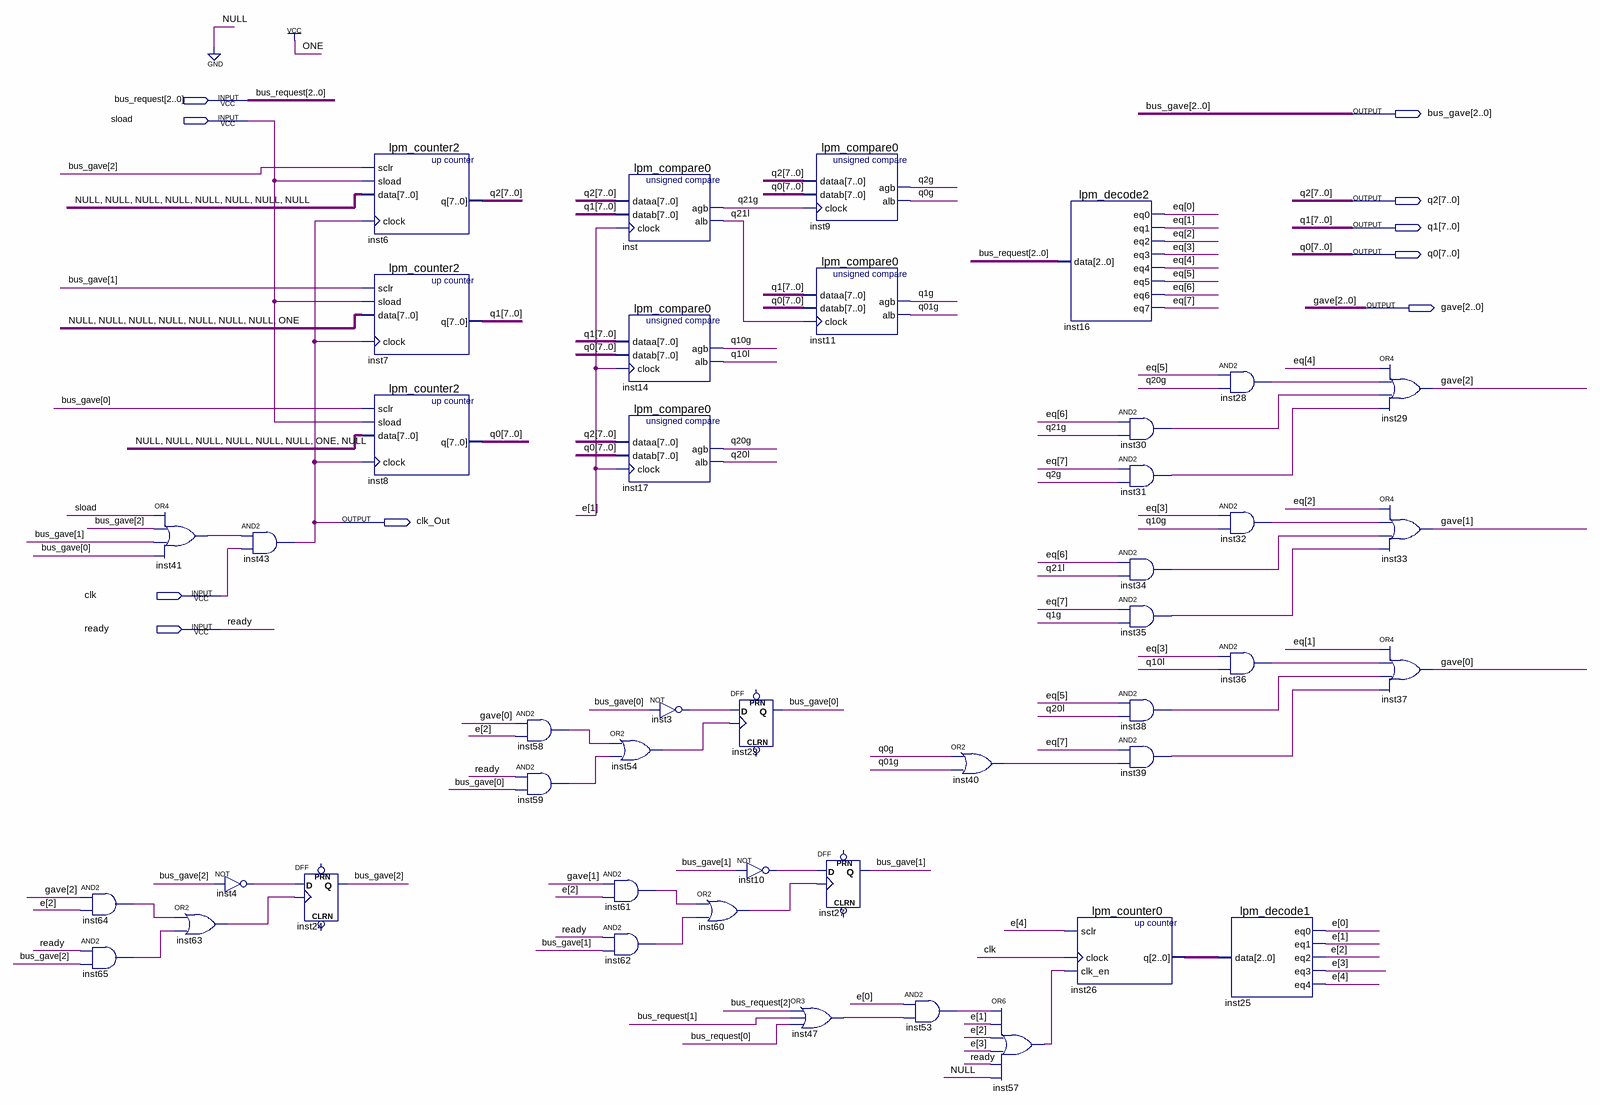
[diagram p0: schematic sheet]
// Quartus schematic arbitrator.bdf as structural Verilog: 44 symbols, 10 pins
module arbitrator (
  input  [2:0] bus_request,
  input  sload,
  input  clk,
  input  ready,
  output [2:0] bus_gave,
  output [7:0] q2,
  output [7:0] q1,
  output [7:0] q0,
  output [2:0] gave,
  output clk_Out
);

  wire inst3_out, inst4_out, inst10_out, inst28_out, inst30_out, inst31_out, inst32_out, inst34_out,
       inst35_out, inst36_out, inst38_out, inst39_out, inst40_out, inst41_out, inst47_out, inst53_out,
       inst54_out, inst57_out, inst58_out, inst59_out, inst60_out, inst61_out, inst62_out, inst63_out,
       inst64_out, inst65_out, q0g, q1g, q01g, q2g, q10g, q10l, q20g, q20l, q21g, q21l;
  wire [2:0] inst26_q;
  wire [4:0] e;
  wire [7:0] eq;

  and inst64 (inst64_out, gave[2], e[2]);
  and inst65 (inst65_out, ready, bus_gave[2]);
  or inst41 (inst41_out, sload, bus_gave[2], bus_gave[1], bus_gave[0]);
  or inst63 (inst63_out, inst64_out, inst65_out);
  and inst43 (clk_Out, inst41_out, clk);
  not inst4 (inst4_out, bus_gave[2]);
  DFF inst24 (.CLK(inst63_out), .D(inst4_out), .Q(bus_gave[2]));  // open: CLRN, PRN
  lpm_counter2 inst6 (.sclr(bus_gave[2]), .sload(sload), .data({8{1'b0}}), .clock(clk_Out), .q(q2));
  lpm_counter2 inst7 (.sclr(bus_gave[1]), .sload(sload), .data(8'b00000001), .clock(clk_Out), .q(q1));
  lpm_counter2 inst8 (.sclr(bus_gave[0]), .sload(sload), .data(8'b00000010), .clock(clk_Out), .q(q0));
  and inst58 (inst58_out, gave[0], e[2]);
  and inst59 (inst59_out, ready, bus_gave[0]);
  lpm_compare0 inst (.dataa(q2), .datab(q1), .clock(e[1]), .agb(q21g), .alb(q21l));
  lpm_compare0 inst14 (.dataa(q1), .datab(q0), .clock(e[1]), .agb(q10g), .alb(q10l));
  lpm_compare0 inst17 (.dataa(q2), .datab(q0), .clock(e[1]), .agb(q20g), .alb(q20l));
  or inst54 (inst54_out, inst58_out, inst59_out);
  and inst61 (inst61_out, gave[1], e[2]);
  and inst62 (inst62_out, ready, bus_gave[1]);
  not inst3 (inst3_out, bus_gave[0]);
  DFF inst23 (.CLK(inst54_out), .D(inst3_out), .Q(bus_gave[0]));  // open: CLRN, PRN
  not inst10 (inst10_out, bus_gave[1]);
  or inst60 (inst60_out, inst61_out, inst62_out);
  or inst47 (inst47_out, bus_request[2], bus_request[1], bus_request[0]);
  lpm_compare0 inst9 (.dataa(q2), .datab(q0), .clock(q21g), .agb(q2g), .alb(q0g));
  lpm_compare0 inst11 (.dataa(q1), .datab(q0), .clock(q21l), .agb(q1g), .alb(q01g));
  DFF inst27 (.CLK(inst60_out), .D(inst10_out), .Q(bus_gave[1]));  // open: CLRN, PRN
  and inst53 (inst53_out, e[0], inst47_out);
  or inst40 (inst40_out, q0g, q01g);
  or inst57 (inst57_out, inst53_out, e[1], e[2], e[3], ready, 1'b0);
  lpm_decode2 inst16 (
    .data(bus_request), .eq0(eq[0]), .eq1(eq[1]), .eq2(eq[2]), .eq3(eq[3]), .eq4(eq[4]), .eq5(eq[5]),
    .eq6(eq[6]), .eq7(eq[7]));
  lpm_counter0 inst26 (.sclr(e[4]), .clock(clk), .clk_en(inst57_out), .q(inst26_q));
  and inst30 (inst30_out, eq[6], q21g);
  and inst31 (inst31_out, eq[7], q2g);
  and inst34 (inst34_out, eq[6], q21l);
  and inst35 (inst35_out, eq[7], q1g);
  and inst38 (inst38_out, eq[5], q20l);
  and inst39 (inst39_out, eq[7], inst40_out);
  and inst28 (inst28_out, eq[5], q20g);
  and inst32 (inst32_out, eq[3], q10g);
  and inst36 (inst36_out, eq[3], q10l);
  lpm_decode1 inst25 (.data(inst26_q), .eq0(e[0]), .eq1(e[1]), .eq2(e[2]), .eq3(e[3]), .eq4(e[4]));
  or inst29 (gave[2], eq[4], inst28_out, inst30_out, inst31_out);
  or inst33 (gave[1], eq[2], inst32_out, inst34_out, inst35_out);
  or inst37 (gave[0], eq[1], inst36_out, inst38_out, inst39_out);
endmodule
